# Altium schematic sheet CP2102_module_microusb_aliexpress.SchDoc
size A4
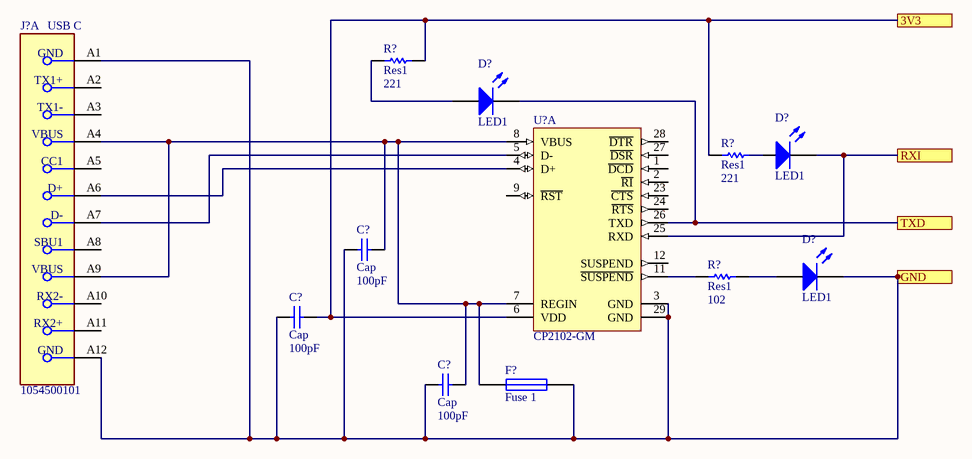
[diagram p0: CP2102_module_microusb_aliexpress.SchDoc]

## Parts
(Parts that share a designator on the sheet are numbered #1, #2 ... from top to bottom, then left to right.)
C?#1  Cap  value 100pF  [RAD-0.3]
C?#2  Cap  value 100pF  [RAD-0.3]
C?#3  Cap  value 100pF  [RAD-0.3]
D?#1  LED1  [LED-1]
D?#2  LED1  [LED-1]
D?#3  LED1  [LED-1]
F?  Fuse 1  [PIN-W2/E2.8]
J?  1054500101  [FP-1054500101-MFG]  (part A of 3)
R?#1  Res1  value 221  [AXIAL-0.3]
R?#2  Res1  value 221  [AXIAL-0.3]
R?#3  Res1  R1: 102  [AXIAL-0.3]
U?  CP2102-GM  [SLAB-QFN-28-3125x3125TP_N]  (part A of 2)

## Ports
3V3, GND, RXI, TXD

## Nets
3V3: C?#2.2 R?#1.2 R?#2.1 U?.6(VDD) ; port 3V3
GND: C?#1.1 C?#2.1 C?#3.1 D?#3.2(K) F?.2 J?.A1(GND) J?.A12(GND) U?.3(GND) U?.29(GND) ; port GND
RXI: D?#2.2(K) U?.25(RXD) ; port RXI
TXD: D?#1.2(K) U?.26(TXD) ; port TXD
NetC?#1_2: C?#1.2 C?#3.2 F?.1 J?.A4(VBUS) J?.A9(VBUS) U?.7(REGIN) U?.8(VBUS)
NetD?#1_1: D?#1.1(A) R?#1.1
NetD?#2_1: D?#2.1(A) R?#2.2
NetD?#3_1: D?#3.1(A) R?#3.2
NetJ?_A6: J?.A6(D+) U?.4(D+)
NetJ?_A7: J?.A7(D-) U?.5(D-)
NetR?#3_1: R?#3.1 U?.11(~{SUSPEND})

Not connected (* = marked no-connect by the designer): J? A2(TX1+) A3(TX1-) A5(CC1) A8(SBU1) A10(RX2-) A11(RX2+); U? 1(~{DCD}) 2(~{RI}) 9(~{RST}) 12(SUSPEND) 23(~{CTS}) 24(~{RTS}) 27(~{DSR}) 28(~{DTR})

## Notes on the sheet
- (near J?) USB C

## Library data of the parts
C?#1-C?#3 = Cap: Capacitor; Published: 8-Jun-2000; LatestRevisionDate: 17-Jul-2002; LatestRevisionNote: Re-released for DXP Platform.; PackageReference: RAD-0.3; Publisher: Altium Limited; PackageDescription: Radial Cap, Thru-Hole; 2 Leads; 0.3 in Pin Spacing
D?#1-D?#3 = LED1: Typical RED GaAs LED; Published: 8-Jun-2000; LatestRevisionDate: 08-Jul-2005; LatestRevisionNote: Mech Layer 1 removed.; PackageReference: LED-1; Publisher: Altium Limited; PackageDescription: LED; 2 Leads
F? = Fuse 1: Fuse; Published: 8-Jun-2000; LatestRevisionDate: 17-Jul-2002; LatestRevisionNote: Re-released for DXP Platform.; PackageReference: PIN-W2/E2.8; Publisher: Altium Limited; PackageDescription: Thru-Hole; 2 Leads
J? = CMP-04767-000004-1: CONN RCP USB3.1 TYPEC 24P SMD RA; Manufacturer: Molex; Number Of Contacts: 24; Voltage Rating: 30V; Shielding: true; Is Female: yes; Current Rating: 0.25/1.25/5A; Pitch: 0.5mm; Conn Orientation: Right Angle; Package: 0; Height: 3.44mm; Footprint Url: https://www.molex.com/pdm_docs/sd/1054500101_sd.pdf; Device Class L1: Connectors; Category: Conn; Device Class L2: USB Connectors; Digikey Description: CONN RCP USB3.1 TYPEC 24P SMD RA; Contact Material: Gold,Nickel; Mouser Description: USB Shielded I/O Receptacle; Type C; Right Angle; Surface Mount; Gold over Nickel; ComponentLink2Description: Datasheet; Lead Free: Yes; Automotive: No; Temperature Range High: +85°C; RoHS: TRUE; Octopart: https://octopart.com/105450-0101-molex-68082325; ComponentLink2URL: https://www.molex.com/webdocs/datasheets/pdf/en-us/1054500101_IO_CONNECTORS.pdf; Temperature: -30°C to +85°C; Usb Standard: USB 3.1; Temperature Range Low: -30°C; Device Class L3: unset; Manufacturer Part Number: 1054500101
R?#1-R?#3 = Res1: Resistor; Published: 8-Jun-2000; LatestRevisionDate: 17-Jul-2002; LatestRevisionNote: Re-released for DXP Platform.; PackageReference: AXIAL-0.3; Publisher: Altium Limited; PackageDescription: Axial Device, Thru-Hole; 2 Leads; 0.3 in Pin Spacing
U? = CMP-0511-00012-1: Single-Chip USB to UART Bridge, 1024 Bytes EEPROM, -40 to 85 degC, 28-pin QFN, Tube; Manufacturer: Silicon Labs; Internal Oscillator: TRUE; Sub-Family: USB Bridges; ComponentLink3Description: Package Specification; PackageDescription: 28-Pin Quad-Flat No-Leads Package, Body 5 x 5 mm, Pitch 0.5 mm; PartNumber: CP2102-GM; EEPROM: 1024 Bytes; Mounting Technology: Surface Mount; ComponentLink2URL: http://www.silabs.com/Support%20Documents/TechnicalDocs/CP2102-9.pdf; DatasheetVersion: Rev. 1.5; ComponentLink1URL: http://www.silabs.com/; ComponentLink2Description: Datasheet; Code_JEDEC: MO-220; PackageReference: QFN-28; Code_IPC: J-STD-020C; ComponentLink3URL: http://www.silabs.com/Support%20Documents/TechnicalDocs/C8051T61x.pdf; ComponentLink1Description: Manufacturer URL